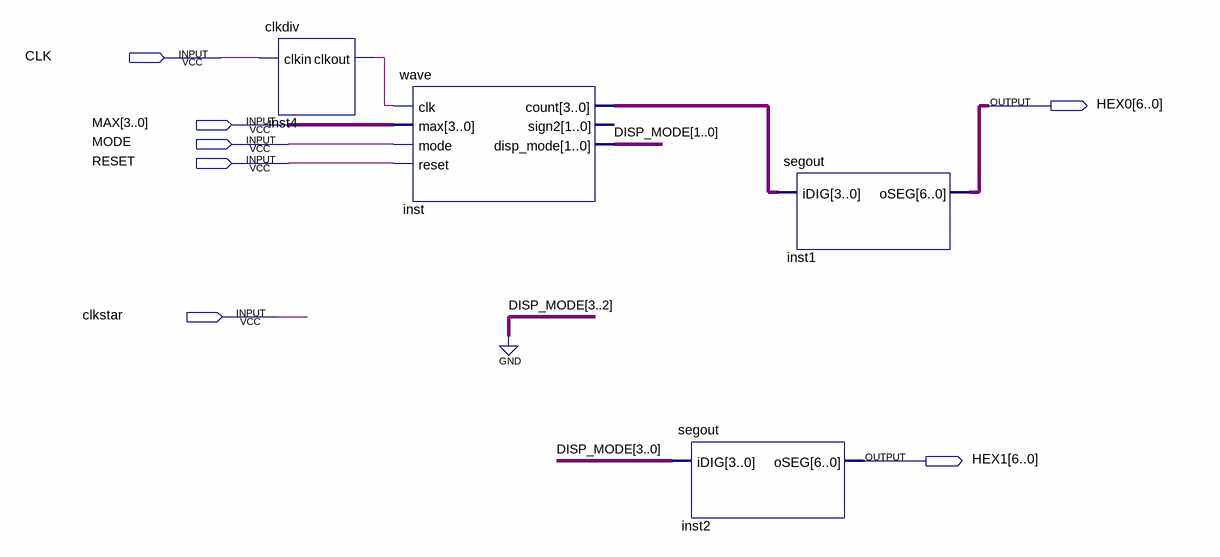
[diagram p0: schematic sheet]
// Quartus schematic wave_down.bdf as structural Verilog: 4 symbols, 7 pins
module wave_down (
  input  CLK,
  input  [3:0] MAX,
  input  MODE,
  input  RESET,
  input  clkstar,
  output [6:0] HEX0,
  output [6:0] HEX1
);

  wire inst4_clkout;
  wire [1:0] DISP_MODE;
  wire [3:0] inst_count;

  clkdiv inst4 (.clkin(CLK), .clkout(inst4_clkout));
  wave inst (
    .clk(inst4_clkout), .max(MAX), .mode(MODE), .reset(RESET), .count(inst_count), .disp_mode(DISP_MODE));  // open: sign2
  segout inst2 (.iDIG({2'b00, DISP_MODE}), .oSEG(HEX1));
  segout inst1 (.iDIG(inst_count), .oSEG(HEX0));
endmodule
